# EAGLE design Cape4all_Beaglebone_Audio_Extension_Rev2 (EAGLE 7.7.0)

## Sheet 1 of 2
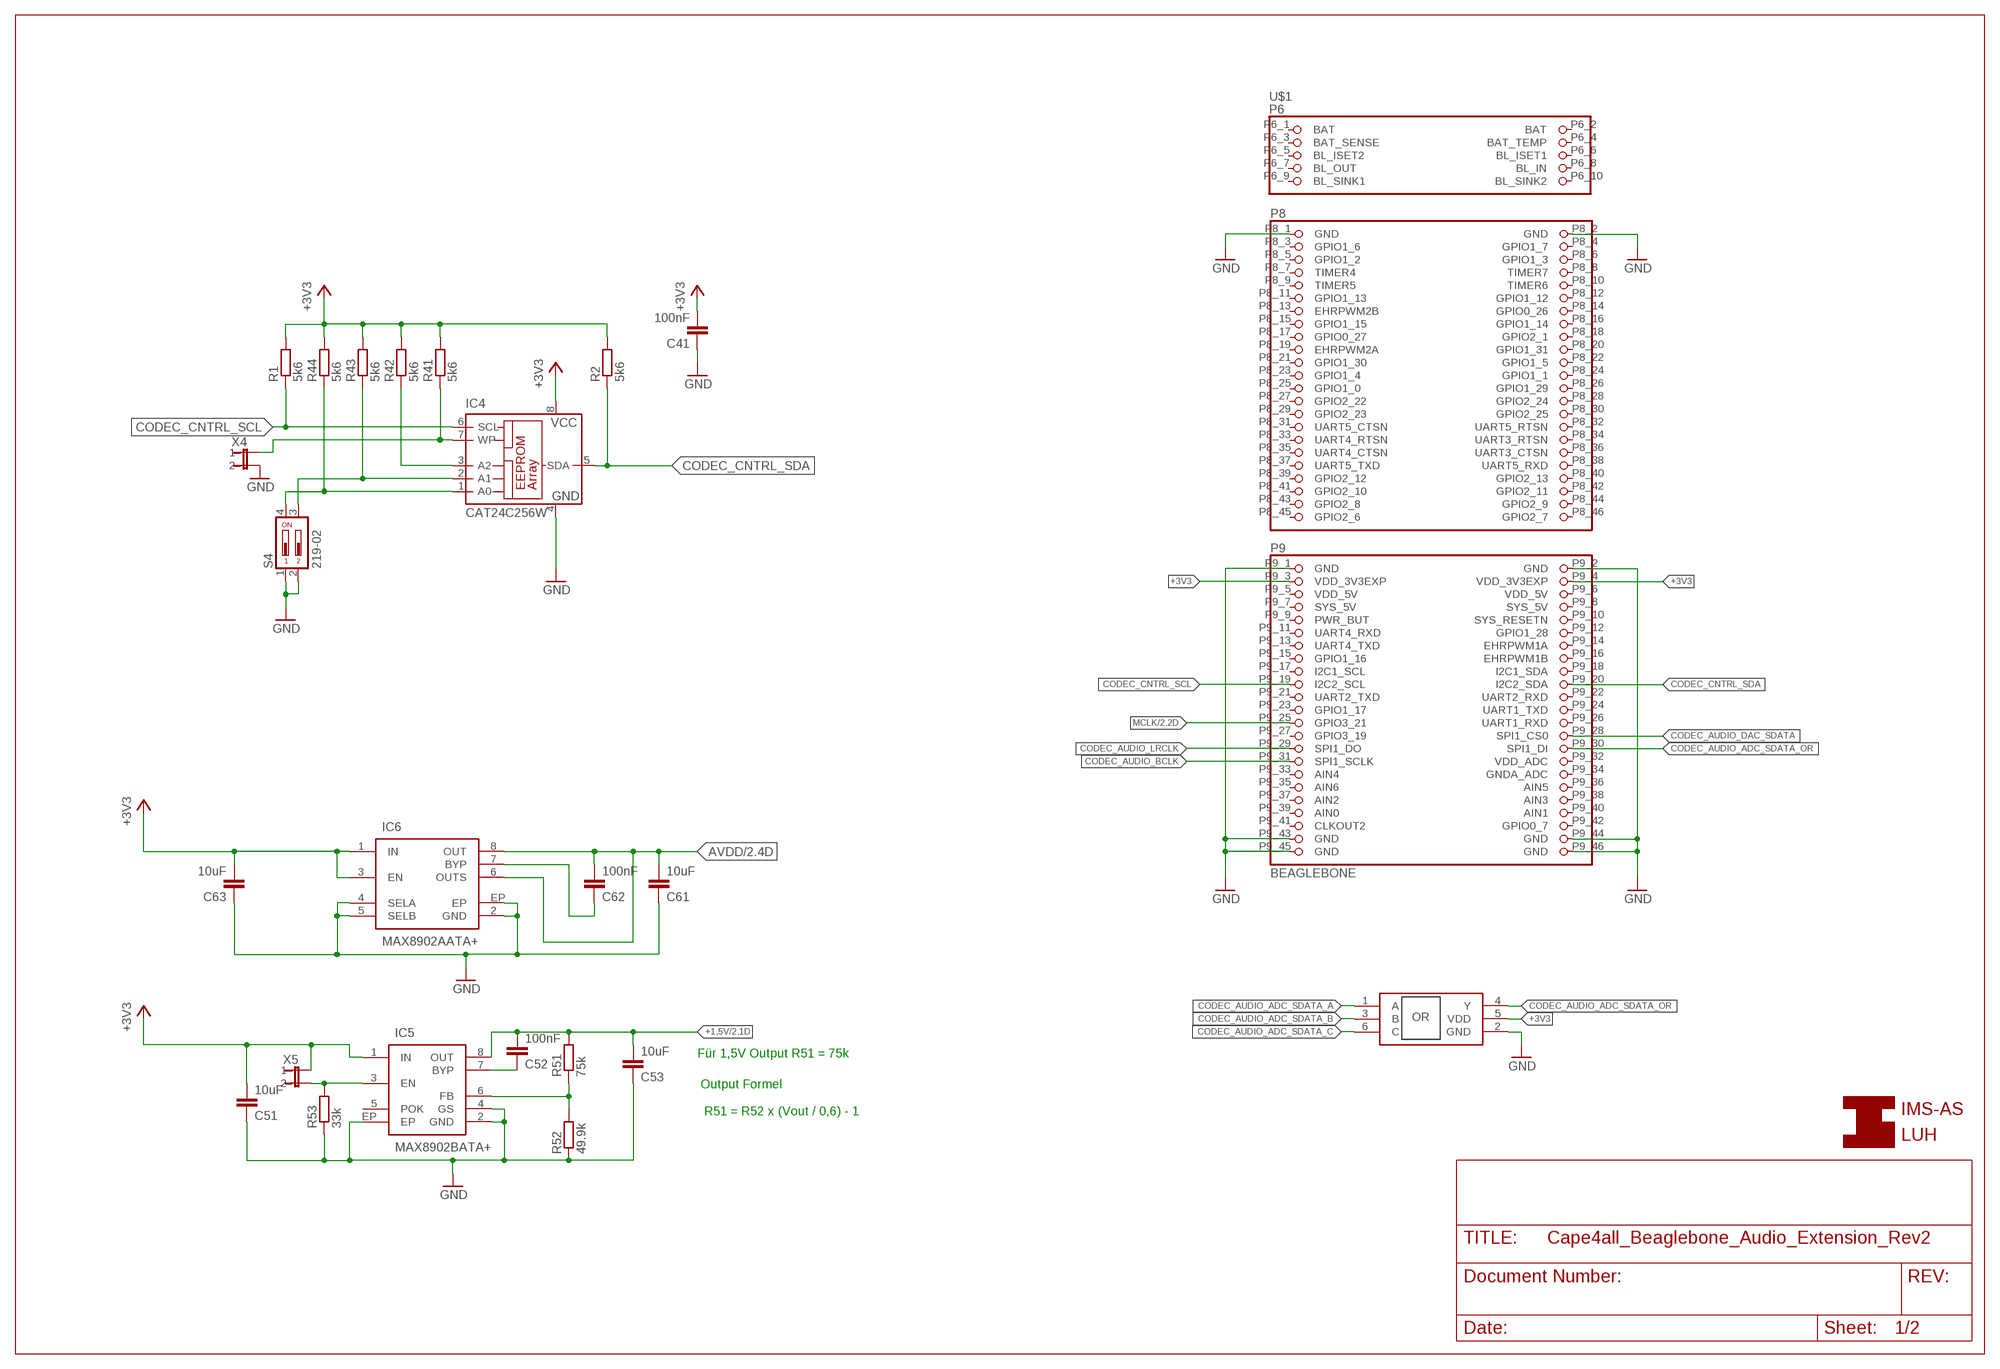
[diagram p0: schematic, sheet 1]

### Parts
C41  100nF  C-EUC0603  [C0603]
C51  10uF  C-EUC0603  [C0603]
C52  100nF  C-EUC0603  [C0603]
C53  10uF  C-EUC0603  [C0603]
C61  10uF  C-EUC0603  [C0603]
C62  100nF  C-EUC0603  [C0603]
C63  10uF  C-EUC0603  [C0603]
IC4  CAT24C256W  24C01ASN  [SO-08]
IC5  MAX8902BATA+  MAX8902B  [8-TDFN-EP]
IC6  MAX8902AATA+  MAX8902A  [8-TDFN-EP]
IC7  SN74LVC1G332SMD  [SOT23-6L]
R1  5k6  R-EU_R0603  [R0603]
R2  5k6  R-EU_R0603  [R0603]
R41  5k6  R-EU_R0603  [R0603]
R42  5k6  R-EU_R0603  [R0603]
R43  5k6  R-EU_R0603  [R0603]
R44  5k6  R-EU_R0603  [R0603]
R51  75k  R-EU_R0603  [R0603]
R52  49.9k  R-EU_R0603  [R0603]
R53  33k  R-EU_R0603  [R0603]
S4  219-02  [CTS-219-02]
U$1  BEAGLEBONE  [BEAGLEBONE]
X4  JP1X2  [JP1X2]
X5  JP1X2  [JP1X2]

### Nets
+1,5V: C52.2 C53.2 IC5.8(OUT) R51.2 ; also sheet 2
+3V3: C41.2 C51.2 C63.2 IC4.8(VCC) IC5.1(IN) IC6.1(IN) IC6.3(EN) IC7.5(VDD) R1.2 R2.2 R41.2 R42.2 R43.2 R44.2 U$1.P9_3(VDD_3V3EXP) U$1.P9_4(VDD_3V3EXP) X5.1 ; also sheet 2
AVDD: C61.2 C62.2 IC6.6(OUTS) IC6.8(OUT) ; also sheet 2
CODEC_AUDIO_ADC_SDATA_A: IC7.1(A) ; also sheet 2
CODEC_AUDIO_ADC_SDATA_B: IC7.3(B) ; also sheet 2
CODEC_AUDIO_ADC_SDATA_C: IC7.6(C) ; also sheet 2
CODEC_AUDIO_ADC_SDATA_OR: IC7.4(Y) U$1.P9_30(SPI1_DI)
CODEC_AUDIO_BCLK: U$1.P9_31(SPI1_SCLK) ; also sheet 2
CODEC_AUDIO_DAC_SDATA: U$1.P9_28(SPI1_CS0) ; also sheet 2
CODEC_AUDIO_LRCLK: U$1.P9_29(SPI1_DO) ; also sheet 2
CODEC_CNTRL_SCL: IC4.6(SCL) R1.1 U$1.P9_19(I2C2_SCL) ; also sheet 2
CODEC_CNTRL_SDA: IC4.5(SDA) R2.1 U$1.P9_20(I2C2_SDA) ; also sheet 2
GND: C41.1 C51.1 C53.1 C61.1 C63.1 IC4.4(GND) IC5.2(GND) IC5.4(GS) IC5.EP IC6.2(GND) IC6.4(SELA) IC6.5(SELB) IC6.EP IC7.2(GND) R52.1 R53.1 S4.1 S4.2 U$1.P8_1(GND) U$1.P8_2(GND) U$1.P9_1(GND) U$1.P9_2(GND) U$1.P9_43(GND) U$1.P9_44(GND) U$1.P9_45(GND) U$1.P9_46(GND) X4.2 ; also sheet 2
MCLK: U$1.P9_25(GPIO3_21) ; also sheet 2
N$7: IC5.3(EN) R53.2 X5.2
N$8: IC4.3(A2) R42.1
N$9: IC4.2(A1) R43.1 S4.3
N$10: IC4.1(A0) R44.1 S4.4
N$11: IC4.7(WP) R41.1 X4.1
N$27: C52.1 IC5.7(BYP)
N$28: IC5.6(FB) R51.1 R52.2
N$34: C62.1 IC6.7(BYP)
Unconnected: IC5.5(POK) U$1.P6_1(BAT) U$1.P6_2(BAT) U$1.P6_3(BAT_SENSE) U$1.P6_4(BAT_TEMP) U$1.P6_5(BL_ISET2) U$1.P6_6(BL_ISET1) U$1.P6_7(BL_OUT) U$1.P6_8(BL_IN) U$1.P6_9(BL_SINK1) U$1.P6_10(BL_SINK2) U$1.P8_3(GPIO1_6) U$1.P8_4(GPIO1_7) U$1.P8_5(GPIO1_2) U$1.P8_6(GPIO1_3) U$1.P8_7(TIMER4) U$1.P8_8(TIMER7) U$1.P8_9(TIMER5) U$1.P8_10(TIMER6) U$1.P8_11(GPIO1_13) U$1.P8_12(GPIO1_12) U$1.P8_13(EHRPWM2B) U$1.P8_14(GPIO0_26) U$1.P8_15(GPIO1_15) U$1.P8_16(GPIO1_14) U$1.P8_17(GPIO0_27) U$1.P8_18(GPIO2_1) U$1.P8_19(EHRPWM2A) U$1.P8_20(GPIO1_31) U$1.P8_21(GPIO1_30) U$1.P8_22(GPIO1_5) U$1.P8_23(GPIO1_4) U$1.P8_24(GPIO1_1) U$1.P8_25(GPIO1_0) U$1.P8_26(GPIO1_29) U$1.P8_27(GPIO2_22) U$1.P8_28(GPIO2_24) U$1.P8_29(GPIO2_23) U$1.P8_30(GPIO2_25) U$1.P8_31(UART5_CTSN) U$1.P8_32(UART5_RTSN) U$1.P8_33(UART4_RTSN) U$1.P8_34(UART3_RTSN) U$1.P8_35(UART4_CTSN) U$1.P8_36(UART3_CTSN) U$1.P8_37(UART5_TXD) U$1.P8_38(UART5_RXD) U$1.P8_39(GPIO2_12) U$1.P8_40(GPIO2_13) U$1.P8_41(GPIO2_10) U$1.P8_42(GPIO2_11) U$1.P8_43(GPIO2_8) U$1.P8_44(GPIO2_9) U$1.P8_45(GPIO2_6) U$1.P8_46(GPIO2_7) U$1.P9_5(VDD_5V) U$1.P9_6(VDD_5V) U$1.P9_7(SYS_5V) U$1.P9_8(SYS_5V) U$1.P9_9(PWR_BUT) U$1.P9_10(SYS_RESETN) U$1.P9_11(UART4_RXD) U$1.P9_12(GPIO1_28) U$1.P9_13(UART4_TXD) U$1.P9_14(EHRPWM1A) U$1.P9_15(GPIO1_16) U$1.P9_16(EHRPWM1B) U$1.P9_17(I2C1_SCL) U$1.P9_18(I2C1_SDA) U$1.P9_21(UART2_TXD) U$1.P9_22(UART2_RXD) U$1.P9_23(GPIO1_17) U$1.P9_24(UART1_TXD) U$1.P9_26(UART1_RXD) U$1.P9_27(GPIO3_19) U$1.P9_32(VDD_ADC) U$1.P9_33(AIN4) U$1.P9_34(GNDA_ADC) U$1.P9_35(AIN6) U$1.P9_36(AIN5) U$1.P9_37(AIN2) U$1.P9_38(AIN3) U$1.P9_39(AIN0) U$1.P9_40(AIN1) U$1.P9_41(CLKOUT2) U$1.P9_42(GPIO0_7)

### Notes on the sheet
- Für 1,5V Output R51 = 75k
- Output Formel
  
   R51 = R52 x (Vout / 0,6) - 1

## Sheet 2 of 2
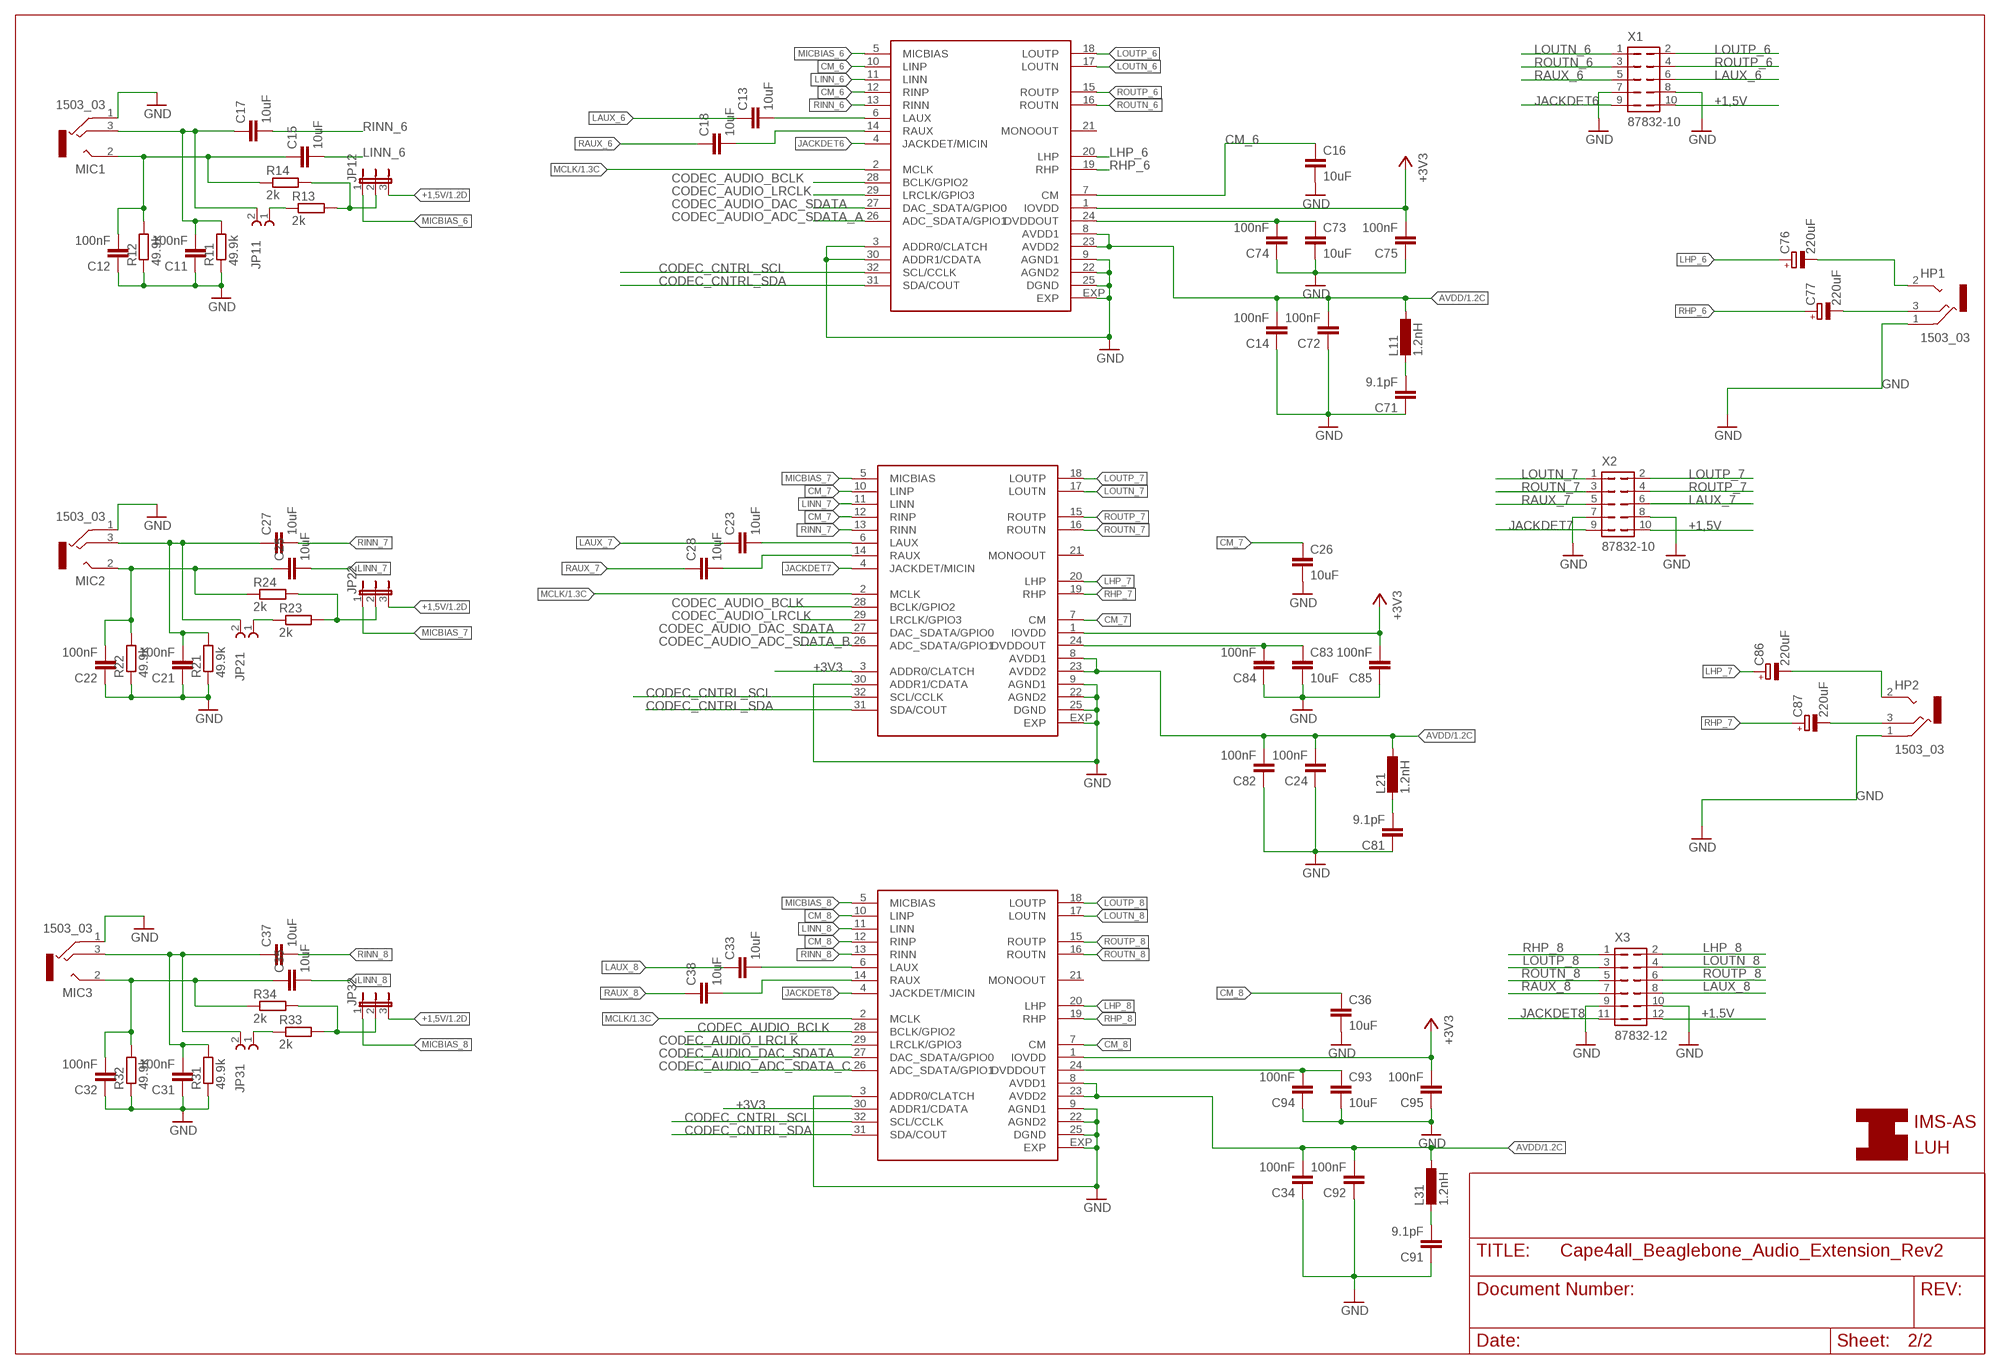
[diagram p1: schematic, sheet 2]

### Parts
C11  100nF  C-EUC0603  [C0603]
C12  100nF  C-EUC0603  [C0603]
C13  10uF  C-EUC0603  [C0603]
C14  100nF  C-EUC0603  [C0603]
C15  10uF  C-EUC0603  [C0603]
C16  10uF  C-EUC0603  [C0603]
C17  10uF  C-EUC0603  [C0603]
C18  10uF  C-EUC0603  [C0603]
C21  100nF  C-EUC0603  [C0603]
C22  100nF  C-EUC0603  [C0603]
C23  10uF  C-EUC0603  [C0603]
C24  100nF  C-EUC0603  [C0603]
C25  10uF  C-EUC0603  [C0603]
C26  10uF  C-EUC0603  [C0603]
C27  10uF  C-EUC0603  [C0603]
C28  10uF  C-EUC0603  [C0603]
C31  100nF  C-EUC0603  [C0603]
C32  100nF  C-EUC0603  [C0603]
C33  10uF  C-EUC0603  [C0603]
C34  100nF  C-EUC0603  [C0603]
C35  10uF  C-EUC0603  [C0603]
C36  10uF  C-EUC0603  [C0603]
C37  10uF  C-EUC0603  [C0603]
C38  10uF  C-EUC0603  [C0603]
C71  9.1pF  C-EUC0603  [C0603]
C72  100nF  C-EUC0603  [C0603]
C73  10uF  C-EUC0603  [C0603]
C74  100nF  C-EUC0603  [C0603]
C75  100nF  C-EUC0603  [C0603]
C76  220uF  CPOL-EUB/3528-21R  [B/3528-21R]
C77  220uF  CPOL-EUB/3528-21R  [B/3528-21R]
C81  9.1pF  C-EUC0603  [C0603]
C82  100nF  C-EUC0603  [C0603]
C83  10uF  C-EUC0603  [C0603]
C84  100nF  C-EUC0603  [C0603]
C85  100nF  C-EUC0603  [C0603]
C86  220uF  CPOL-EUB/3528-21R  [B/3528-21R]
C87  220uF  CPOL-EUB/3528-21R  [B/3528-21R]
C91  9.1pF  C-EUC0603  [C0603]
C92  100nF  C-EUC0603  [C0603]
C93  10uF  C-EUC0603  [C0603]
C94  100nF  C-EUC0603  [C0603]
C95  100nF  C-EUC0603  [C0603]
HP1  1503_03  [1503_03]
HP2  1503_03  [1503_03]
IC1  ADAU1761BCPZ  ADAU1761  [LFCSP32]
IC2  ADAU1761BCPZ  ADAU1761  [LFCSP32]
IC3  ADAU1761BCPZ  ADAU1761  [LFCSP32]
JP11  62000211121  [62000211121]
JP12  JP1X3  [JP1X3]
JP21  62000211121  [62000211121]
JP22  JP1X3  [JP1X3]
JP31  62000211121  [62000211121]
JP32  JP1X3  [JP1X3]
L11  1.2nH  L-EUL0603  [R0603]
L21  1.2nH  L-EUL0603  [R0603]
L31  1.2nH  L-EUL0603  [R0603]
MIC1  1503_03  [1503_03]
MIC2  1503_03  [1503_03]
MIC3  1503_03  [1503_03]
R11  49.9k  R-EU_R0603  [R0603]
R12  49.9k  R-EU_R0603  [R0603]
R13  2k  R-EU_R0603  [R0603]
R14  2k  R-EU_R0603  [R0603]
R21  49.9k  R-EU_R0603  [R0603]
R22  49.9k  R-EU_R0603  [R0603]
R23  2k  R-EU_R0603  [R0603]
R24  2k  R-EU_R0603  [R0603]
R31  49.9k  R-EU_R0603  [R0603]
R32  49.9k  R-EU_R0603  [R0603]
R33  2k  R-EU_R0603  [R0603]
R34  2k  R-EU_R0603  [R0603]
X1  87832-10  [87832-10]
X2  87832-10  [87832-10]
X3  87832-12  [87832-12]

### Nets
+1,5V: JP12.3 JP22.3 JP32.3 X1.10 X2.10 X3.12 ; also sheet 1
+3V3: C75.2 C85.2 C95.2 IC1.1(IOVDD) IC2.1(IOVDD) IC2.3(ADDR0/CLATCH) IC3.1(IOVDD) IC3.30(ADDR1/CDATA) ; also sheet 1
AVDD: C14.2 C24.2 C34.2 C72.2 C82.2 C92.2 IC1.8(AVDD1) IC1.23(AVDD2) IC2.8(AVDD1) IC2.23(AVDD2) IC3.8(AVDD1) IC3.23(AVDD2) L11.1 L21.1 L31.1 ; also sheet 1
CM_6: C16.1 IC1.7(CM) IC1.10(LINP) IC1.12(RINP)
CM_7: C26.1 IC2.7(CM) IC2.10(LINP) IC2.12(RINP)
CM_8: C36.1 IC3.7(CM) IC3.10(LINP) IC3.12(RINP)
CODEC_AUDIO_ADC_SDATA_A: IC1.26(ADC_SDATA/GPIO1) ; also sheet 1
CODEC_AUDIO_ADC_SDATA_B: IC2.26(ADC_SDATA/GPIO1) ; also sheet 1
CODEC_AUDIO_ADC_SDATA_C: IC3.26(ADC_SDATA/GPIO1) ; also sheet 1
CODEC_AUDIO_BCLK: IC1.28(BCLK/GPIO2) IC2.28(BCLK/GPIO2) IC3.28(BCLK/GPIO2) ; also sheet 1
CODEC_AUDIO_DAC_SDATA: IC1.27(DAC_SDATA/GPIO0) IC2.27(DAC_SDATA/GPIO0) IC3.27(DAC_SDATA/GPIO0) ; also sheet 1
CODEC_AUDIO_LRCLK: IC1.29(LRCLK/GPIO3) IC2.29(LRCLK/GPIO3) IC3.29(LRCLK/GPIO3) ; also sheet 1
CODEC_CNTRL_SCL: IC1.32(SCL/CCLK) IC2.32(SCL/CCLK) IC3.32(SCL/CCLK) ; also sheet 1
CODEC_CNTRL_SDA: IC1.31(SDA/COUT) IC2.31(SDA/COUT) IC3.31(SDA/COUT) ; also sheet 1
DVDDOUT_6: C73.1 C74.2 IC1.24(DVDDOUT)
DVDDOUT_7: C83.1 C84.2 IC2.24(DVDDOUT)
DVDDOUT_8: C93.1 C94.2 IC3.24(DVDDOUT)
GND: C11.1 C12.1 C14.1 C16.2 C21.1 C22.1 C24.1 C26.2 C31.1 C32.1 C34.1 C36.2 C71.1 C72.1 C73.2 C74.1 C75.1 C81.1 C82.1 C83.2 C84.1 C85.1 C91.1 C92.1 C93.2 C94.1 C95.1 HP1.1 HP2.1 IC1.3(ADDR0/CLATCH) IC1.9(AGND1) IC1.22(AGND2) IC1.25(DGND) IC1.30(ADDR1/CDATA) IC1.EXP IC2.9(AGND1) IC2.22(AGND2) IC2.25(DGND) IC2.30(ADDR1/CDATA) IC2.EXP IC3.3(ADDR0/CLATCH) IC3.9(AGND1) IC3.22(AGND2) IC3.25(DGND) IC3.EXP MIC1.1 MIC2.1 MIC3.1 R11.1 R12.1 R21.1 R22.1 R31.1 R32.1 X1.7 X1.8 X2.7 X2.8 X3.9 X3.10 ; also sheet 1
JACKDET6: IC1.4(JACKDET/MICIN) X1.9
JACKDET7: IC2.4(JACKDET/MICIN) X2.9
JACKDET8: IC3.4(JACKDET/MICIN) X3.11
LAUX_6: C13.1 X1.6
LAUX_7: C23.1 X2.6
LAUX_8: C33.1 X3.8
LHP_6: C76.+ IC1.20(LHP)
LHP_7: C86.+ IC2.20(LHP)
LHP_8: IC3.20(LHP) X3.2
LINN_6: C15.2 IC1.11(LINN)
LINN_7: C25.2 IC2.11(LINN)
LINN_8: C35.2 IC3.11(LINN)
LOUTN_6: IC1.17(LOUTN) X1.1
LOUTN_7: IC2.17(LOUTN) X2.1
LOUTN_8: IC3.17(LOUTN) X3.4
LOUTP_6: IC1.18(LOUTP) X1.2
LOUTP_7: IC2.18(LOUTP) X2.2
LOUTP_8: IC3.18(LOUTP) X3.3
MCLK: IC1.2(MCLK) IC2.2(MCLK) IC3.2(MCLK) ; also sheet 1
MIC1L: C12.2 C15.1 MIC1.2 R12.2 R14.1
MIC1R: C11.2 C17.1 JP11.2 MIC1.3 R11.2
MIC2L: C22.2 C25.1 MIC2.2 R22.2 R24.1
MIC2R: C21.2 C27.1 JP21.2 MIC2.3 R21.2
MIC3L: C32.2 C35.1 MIC3.2 R32.2 R34.1
MIC3R: C31.2 C37.1 JP31.2 MIC3.3 R31.2
MICBIAS_6: IC1.5(MICBIAS) JP12.1
MICBIAS_7: IC2.5(MICBIAS) JP22.1
MICBIAS_8: IC3.5(MICBIAS) JP32.1
N$1: C91.2 L31.2
N$2: C71.2 L11.2
N$3: C23.2 IC2.6(LAUX)
N$4: C28.2 IC2.14(RAUX)
N$5: C13.2 IC1.6(LAUX)
N$6: C18.2 IC1.14(RAUX)
N$12: C33.2 IC3.6(LAUX)
N$13: C38.2 IC3.14(RAUX)
N$14: JP11.1 R13.1
N$15: JP21.1 R23.1
N$18: JP31.1 R33.1
N$29: JP32.2 R33.2 R34.2
N$31: JP12.2 R13.2 R14.2
N$32: JP22.2 R23.2 R24.2
N$56: C87.- HP2.3
N$65: C86.- HP2.2
N$91: C81.2 L21.2
N$94: C77.- HP1.3
N$95: C76.- HP1.2
RAUX_6: C18.1 X1.5
RAUX_7: C28.1 X2.5
RAUX_8: C38.1 X3.7
RHP_6: C77.+ IC1.19(RHP)
RHP_7: C87.+ IC2.19(RHP)
RHP_8: IC3.19(RHP) X3.1
RINN_6: C17.2 IC1.13(RINN)
RINN_7: C27.2 IC2.13(RINN)
RINN_8: C37.2 IC3.13(RINN)
ROUTN_6: IC1.16(ROUTN) X1.3
ROUTN_7: IC2.16(ROUTN) X2.3
ROUTN_8: IC3.16(ROUTN) X3.5
ROUTP_6: IC1.15(ROUTP) X1.4
ROUTP_7: IC2.15(ROUTP) X2.4
ROUTP_8: IC3.15(ROUTP) X3.6
Unconnected: HP1.GND HP1.GND2 HP2.GND HP2.GND2 IC1.21(MONOOUT) IC2.21(MONOOUT) IC3.21(MONOOUT) MIC1.GND MIC1.GND2 MIC2.GND MIC2.GND2 MIC3.GND MIC3.GND2

## Library data of the parts
C11-C18 C21-C28 C31-C38 C41 C51-C53 C61-C63 C71-C75 C81-C85 C91-C95 = rcl:C-EU: CAPACITOR, European symbol
C76 C77 C86 C87 = rcl:CPOL-EU: POLARIZED CAPACITOR, European symbol
HP1 HP2 MIC1-MIC3 = con-lumberg:1503_03: Jack connectors according to JISC 6560, 3.5 mm Klinkeneinbaukupplung nach JISC 6560, 3,5 mm, 3-polig/stereo, abgewinkelte Ausführung, Surface-Mount-Technik (SMT) Source: http://www.lumberg.com/Produkte/PDFs/1503_02.pdf
IC1-IC3 = audio:ADAU1761: Analog Devices ADAU1761 Audio Codec
IC4 = microchip:24C*: Serial EEPROM 1 K/2 K/4 K
IC5 = regulators:MAX8902B: Maxim Low-Noise 500mA LDO Regulator in a 2mm x 2mm TDFN Package
IC6 = regulators:MAX8902A: Maxim Integrated MAX8902A Low-Noise 500mA LDO Regulator
IC7 = audio:SN74LVC1G332: 3-Input OR-Gate SMD SOT23-6 Farnell: SN74LVC1G332DBVR (2334917) <http://de.farnell.com/texas-instruments/sn74lvc1g332dbvr/logic-or-gate-sot-23-6/dp/2334917>
JP11 JP21 JP31 = EAGLE-BOARD-TO-BOARD_CONNECTORS-rev17a:62000211121: WR-PHD 2.00mm Pin Header, 2 Pins=>Code : Con_BTB_PHD_2.00_1_THT_62000211121 <http://katalog.we-online.de/media/images/eican/Con_BTB_PHD_2.00_1_THT_6200xx11121_pf2.jpg> Details see: http://katalog.we-online.de/en/em/620_0xx_111_21 Created 2014-06-03, Karrer Zheng 2014 (C) Würth Elektronik
JP12 JP22 JP32 = lib_soeren:JP1X3: Jumper 1x3
L11 L21 L31 = rcl:L-EU: INDUCTOR, European symbol
R1 R2 R11-R14 R21-R24 R31-R34 R41-R44 R51-R53 = rcl:R-EU_: RESISTOR, European symbol
S4 = switch-dil:219-02*: Surface Mount DIP Switch Series 219 SMT CTS Electronic Components Sourc: www.ctscorp.com
U$1 = lib_soeren:BEAGLEBONE: BeagleBoneBlack Cape nach BeagleBone Black System Reference Manual Rev. C1
X1 X2 = con-molex:87832-10: Milli-Grid Header 2.00mm (.079") Pitch
X3 = con-molex:87832-12: Milli-Grid Header 2.00mm (.079") Pitch
X4 X5 = lib_soeren:JP1X2: Jumper 1x2

## Board
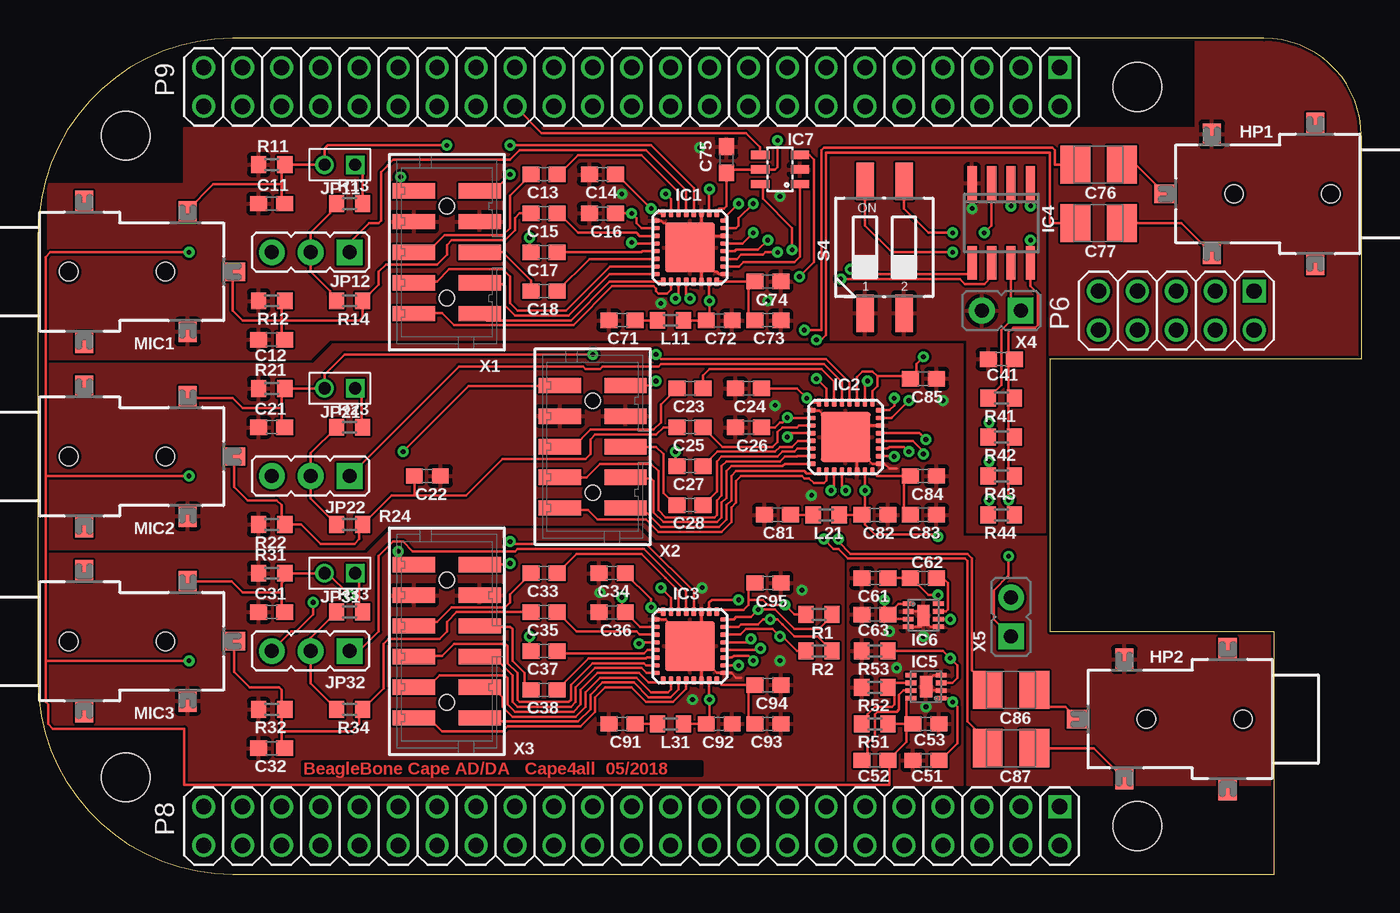
[diagram p2: board, top side]
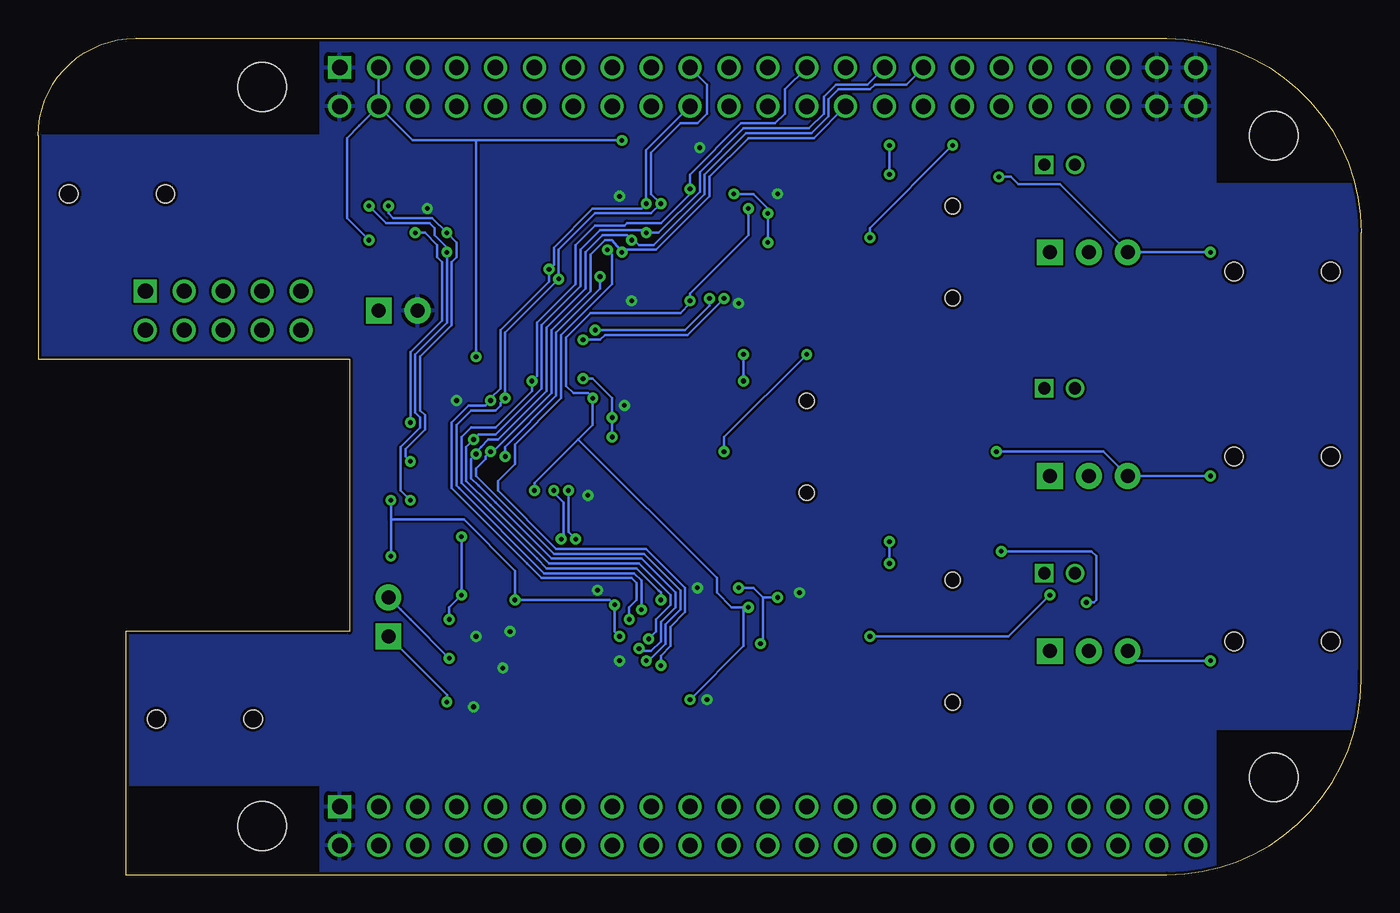
[diagram p3: board, bottom side, seen from below]

Size 86.36 x 54.61 mm. Coordinates in mm from the lower left corner, seen from the top.
Copper layers (1+2*15+16): Top 0.035mm / dielectric 0.36mm / Route2 0.018mm / dielectric 0.71mm / Route15 0.018mm / dielectric 0.36mm / Bottom 0.035mm
Design rules "qp_designrules_6mil *": minimum track width 6mil, minimum drill 0.3mm, track to track 6mil, track to pad 6mil, pad to pad 6mil, via to via 6mil, smd to smd 6mil, copper to edge 8mil, drill to drill 10mil, minimum pad ring 8mil, minimum via ring 8mil, stop-mask expansion 4mil, vias tented up to drill 16mil, thermal gap 10mil

### Footprints (pad centres in the part's own frame; a part is rotated, then mirrored left to right if it is on the bottom)
C0603 = smd 1.1 x 1: 1 -0.85,0; 2 0.85,0
B/3528-21R = smd 1.95 x 2.5: + 1.525,0; - -1.525,0
1503_03 = smd 1.4 x 1.2: 1 -3.9,-9.75; 3 3.9,-9.75; GND -4.6,-3; GND2 4.6,-3 | smd 1.2 x 1.4: 2 0,-12.8 | hole 1.2: 0,-2; 0,-8.3
LFCSP32 = smd 0.55 x 0.3: 1 -2.25,1.75; 2 -2.25,1.25; 3 -2.25,0.75; 4 -2.25,0.25; 5 -2.25,-0.25; 6 -2.25,-0.75; 7 -2.25,-1.25; 8 -2.25,-1.75; 17 2.25,-1.75; 18 2.25,-1.25; 19 2.25,-0.75; 20 2.25,-0.25; 21 2.25,0.25; 22 2.25,0.75; 23 2.25,1.25; 24 2.25,1.75 | smd 0.3 x 0.55: 9 -1.75,-2.25; 10 -1.25,-2.25; 11 -0.75,-2.25; 12 -0.25,-2.25; 13 0.25,-2.25; 14 0.75,-2.25; 15 1.25,-2.25; 16 1.75,-2.25; 25 1.75,2.25; 26 1.25,2.25; 27 0.75,2.25; 28 0.25,2.25; 29 -0.25,2.25; 30 -0.75,2.25; 31 -1.25,2.25; 32 -1.75,2.25 | smd 3.25 x 3.25: EXP 0,0
SO-08 = smd 0.6 x 2.2: 1 -1.905,-2.6; 2 -0.635,-2.6; 3 0.635,-2.6; 4 1.905,-2.6; 5 1.905,2.6; 6 0.635,2.6; 7 -0.635,2.6; 8 -1.905,2.6
8-TDFN-EP = smd 0.7 x 0.3: 1 -1,0.7; 2 -1,0.2; 3 -1,-0.3; 4 -1,-0.8; 5 0.98,-0.8; 6 0.98,-0.3; 7 0.98,0.2; 8 0.98,0.7 | smd 0.8 x 1.38: EP -0.01,-0.05
SOT23-6L = smd 0.55 x 1.2: 1 -0.95,-1.3; 2 0,-1.3; 3 0.95,-1.3; 4 0.95,1.3; 5 0,1.3; 6 -0.95,1.3
62000211121 = drill 0.8 square: 1 -1,0 | drill 0.8: 2 1,0
JP1X3 = drill 0.914 pad 1.676 square: 1 -2.54,0 | drill 0.914 pad 1.676: 2 0,0; 3 2.54,0
R0603 = smd 1 x 1.1: 1 -0.85,0; 2 0.85,0
CTS-219-02 = smd 1.13 x 2.44: 1 -1.27,-4.3; 2 1.27,-4.3; 3 1.27,4.3; 4 -1.27,4.3
BEAGLEBONE = drill 1 square: P6_1 6.985,16.51; P8_1 19.685,50.165; P9_1 19.685,1.905 | drill 1: P6_2 6.985,19.05; P6_3 9.525,16.51; P6_4 9.525,19.05; P6_5 12.065,16.51; P6_6 12.065,19.05; P6_7 14.605,16.51; P6_8 14.605,19.05; P6_9 17.145,16.51; P6_10 17.145,19.05; P8_2 19.685,52.705; P8_3 22.225,50.165; P8_4 22.225,52.705; P8_5 24.765,50.165; P8_6 24.765,52.705; P8_7 27.305,50.165; P8_8 27.305,52.705; P8_9 29.845,50.165; P8_10 29.845,52.705; P8_11 32.385,50.165; P8_12 32.385,52.705; P8_13 34.925,50.165; P8_14 34.925,52.705; P8_15 37.465,50.165; P8_16 37.465,52.705; P8_17 40.005,50.165; P8_18 40.005,52.705; P8_19 42.545,50.165; P8_20 42.545,52.705; P8_21 45.085,50.165; P8_22 45.085,52.705; P8_23 47.625,50.165; P8_24 47.625,52.705; P8_25 50.165,50.165; P8_26 50.165,52.705; P8_27 52.705,50.165; P8_28 52.705,52.705; P8_29 55.245,50.165; P8_30 55.245,52.705; P8_31 57.785,50.165; P8_32 57.785,52.705; P8_33 60.325,50.165; P8_34 60.325,52.705; P8_35 62.865,50.165; P8_36 62.865,52.705; P8_37 65.405,50.165; P8_38 65.405,52.705; P8_39 67.945,50.165; P8_40 67.945,52.705; P8_41 70.485,50.165; P8_42 70.485,52.705; P8_43 73.025,50.165; P8_44 73.025,52.705; P8_45 75.565,50.165; P8_46 75.565,52.705; P9_2 19.685,4.445; P9_3 22.225,1.905; P9_4 22.225,4.445; P9_5 24.765,1.905; P9_6 24.765,4.445; P9_7 27.305,1.905; P9_8 27.305,4.445; P9_9 29.845,1.905; P9_10 29.845,4.445; P9_11 32.385,1.905; P9_12 32.385,4.445; P9_13 34.925,1.905; P9_14 34.925,4.445; P9_15 37.465,1.905; P9_16 37.465,4.445; P9_17 40.005,1.905; P9_18 40.005,4.445; P9_19 42.545,1.905; P9_20 42.545,4.445; P9_21 45.085,1.905; P9_22 45.085,4.445; P9_23 47.625,1.905; P9_24 47.625,4.445; P9_25 50.165,1.905; P9_26 50.165,4.445; P9_27 52.705,1.905; P9_28 52.705,4.445; P9_29 55.245,1.905; P9_30 55.245,4.445; P9_31 57.785,1.905; P9_32 57.785,4.445; P9_33 60.325,1.905; P9_34 60.325,4.445; P9_35 62.865,1.905; P9_36 62.865,4.445; P9_37 65.405,1.905; P9_38 65.405,4.445; P9_39 67.945,1.905; P9_40 67.945,4.445; P9_41 70.485,1.905; P9_42 70.485,4.445; P9_43 73.025,1.905; P9_44 73.025,4.445; P9_45 75.565,1.905; P9_46 75.565,4.445 | hole 3.175: 14.605,3.175; 14.605,51.435; 80.645,6.35; 80.645,48.26
87832-10 = smd 1 x 2.75: 1 -4,-2.15; 2 -4,2.15; 3 -2,-2.15; 4 -2,2.15; 5 0,-2.15; 6 0,2.15; 7 2,-2.15; 8 2,2.15; 9 4,-2.15; 10 4,2.15 | hole 1: -3,0; 3,0
87832-12 = smd 1 x 2.75: 1 -5,-2.15; 2 -5,2.15; 3 -3,-2.15; 4 -3,2.15; 5 -1,-2.15; 6 -1,2.15; 7 1,-2.15; 8 1,2.15; 9 3,-2.15; 10 3,2.15; 11 5,-2.15; 12 5,2.15 | hole 1: -4,0; 4,0
JP1X2 = drill 0.914 pad 1.676 square: 1 -1.27,0 | drill 0.914 pad 1.676: 2 1.27,0

### Placement (x,y rotation side)
C11  15.24,43.81 0 top
C12  15.24,34.92 0 top
C13  33.02,45.72 0 top
C14  36.83,45.72 0 top
C15  33.02,43.18 0 top
C16  36.83,43.18 180 top
C17  33.02,40.64 0 top
C18  33.02,38.1 0 top
C21  15.24,29.21 0 top
C22  25.4,26.04 180 top
C23  42.55,31.75 0 top
C24  46.35,31.75 0 top
C25  42.55,29.21 0 top
C26  46.35,29.21 180 top
C27  42.55,26.67 0 top
C28  42.55,24.13 0 top
C31  15.24,17.14 0 top
C32  15.24,8.26 0 top
C33  33.02,19.68 0 top
C34  37.47,19.68 0 top
C35  33.02,17.14 0 top
C36  37.47,17.14 180 top
C37  33.02,14.61 0 top
C38  33.02,12.06 0 top
C41  62.86,33.66 0 top
C51  57.94,7.46 0 top
C52  54.61,7.46 0 top
C53  57.94,9.84 180 top
C61  54.61,19.37 0 top
C62  57.78,19.37 180 top
C63  54.61,16.99 0 top
C71  38.1,36.2 0 top
C72  44.45,36.2 180 top
C73  47.62,36.2 0 top
C74  47.62,38.73 180 top
C75  44.93,46.67 270 top
C76  69.22,46.35 180 top
C77  69.22,42.55 180 top
C81  48.26,23.5 0 top
C82  54.61,23.5 180 top
C83  57.78,23.5 0 top
C84  57.78,26.04 180 top
C85  57.78,32.38 180 top
C86  63.5,12.06 180 top
C87  63.5,8.26 180 top
C91  38.1,9.84 0 top
C92  44.45,9.84 180 top
C93  47.62,9.84 0 top
C94  47.62,12.38 180 top
C95  47.62,19.05 180 top
HP1  86.36,44.45 270 top
HP2  80.64,10.16 270 top
IC1  42.55,40.96 270 top
IC2  52.7,28.57 270 top
IC3  42.55,14.92 270 top
IC4  62.87,42.55 180 top
IC5  57.94,12.22 180 top
IC6  57.78,16.99 0 top
IC7  48.42,46.04 90 top
JP11  19.68,46.35 180 top
JP12  17.78,40.64 180 top
JP21  19.68,31.75 180 top
JP22  17.78,26.04 180 top
JP31  19.68,19.68 180 top
JP32  17.78,14.61 180 top
L11  41.27,36.2 180 top
L21  51.44,23.5 180 top
L31  41.27,9.84 180 top
MIC1  0,39.37 90 top
MIC2  0,27.3 90 top
MIC3  0,15.24 90 top
R1  50.96,16.99 180 top
R2  50.96,14.61 180 top
R11  15.24,46.35 0 top
R12  15.24,37.47 0 top
R13  20.32,43.81 180 top
R14  20.32,37.47 180 top
R21  15.24,31.75 0 top
R22  15.24,22.86 0 top
R23  20.32,29.21 180 top
R24  20.32,22.86 180 top
R31  15.24,19.68 0 top
R32  15.24,10.79 0 top
R33  20.32,17.14 180 top
R34  20.32,10.79 180 top
R41  62.87,31.11 0 top
R42  62.87,28.57 0 top
R43  62.87,26.04 0 top
R44  62.87,23.5 0 top
R51  54.61,9.84 0 top
R52  54.61,12.22 0 top
R53  54.61,14.61 0 top
S4  55.24,40.96 0 top
U$1  86.36,54.61 180 top
X1  26.67,40.64 90 top
X2  36.2,27.94 90 top
X3  26.67,15.24 90 top
X4  62.87,36.83 180 top
X5  63.5,16.83 90 top

### Tracks (layer width: path | path; a pad name or v marks a point on that pad's centre or on a via)
+1,5V  (via drill 0.3)
  Top 0.152: X1.10 23.68,44.64 23.65,44.61 v23.65,45.56 | v23.81,27.62 28.1,31.91 32.86,31.91 33.02,32.07 33.92,32.07 X2.10 | JP32.3 16.51,15.88 16.83,15.88 17.94,16.99 v17.94,17.78 | v23.5,21.11 23.5,20.16 24.44,20.16 X3.12 | IC5.8 56.77,11.52 56.67,11.43 56.67,10.26 C53.2 | C53.2 57.09,9.79 56.67,9.37 56.67,8.68 C52.2 55.56,7.36 55.56,5.87 9.53,5.87 9.53,9.53 0.95,9.53 0.64,9.84 0.64,11.11 0.48,11.27 0.48,13.97 | R51.2 C53.2 | 0.48,40.32 | 0.48,26.04 v9.84,26.04 | 0.48,13.97 0.48,26.04 | v9.84,40.64 0.79,40.64 0.48,40.32 | 0.48,13.97 v9.84,13.97 | 0.48,26.04 | 0.48,26.04 0.48,40.32
  Bottom 0.152: v23.81,27.62 16.83,27.62 JP22.3 v9.84,26.04 | JP32.3 14.61,13.97 v9.84,13.97 | v9.84,40.64 JP12.3 19.68,45.09 22.38,45.09 22.86,45.56 v23.65,45.56 | v17.94,17.78 17.46,17.78 17.3,17.94 17.3,20.8 17.62,21.11 23.34,21.11 v23.5,21.11
+3V3  (via drill 0.3)
  Top 0.152: R44.2 63.34,23.87 v63.34,24.45 63.34,26.04 R43.2 63.34,26.41 63.34,28.57 R42.2 63.34,28.95 63.34,30.96 63.5,31.11 R41.2 63.34,31.49 63.34,33.5 63.5,33.66 C41.2 63.34,33.66 63.34,35.4 63.66,35.72 65.09,35.72 65.25,35.88 65.25,37.94 64.77,38.42 IC4.8 v64.77,41.43 | IC1.1 44.3,43.34 44.45,43.5 44.77,43.5 44.93,43.66 C75.2 45.14,46.04 IC7.5 48.1,46.04 48.26,46.2 v48.26,47.94 | IC2.3 53.45,32.5 53.82,32.86 54.45,32.86 54.77,32.54 | 54.77,32.54 54.77,31.91 54.45,31.59 54.45,30.95 IC2.1 | 46.35,17.94 46.35,17.62 46.03,17.3 44.42,17.3 IC3.1 | 46.35,17.94 46.35,18.63 C95.2 46.77,18.95 | IC3.30 45.84,15.67 46.2,16.03 47.94,16.03 v48.42,15.56 48.58,15.56 49.53,14.61 | 54.77,32.54 56.52,32.54 56.67,32.38 C85.2 56.94,32.49 57.31,32.86 57.31,33.34 v57.78,33.81 | 46.35,17.94 47.31,17.94 47.62,17.62 v48.74,17.62 | 49.53,14.61 | 49.53,14.61 R2.2 | R1.2 49.37,16.99 v48.74,17.62 | v48.74,17.62 | C51.2 58.9,7.46 60.01,8.57 60.01,10.95 v59.69,11.27 | 55.46,16.73 55.24,16.51 v55.24,17.94 | v59.69,11.27 59.47,11.49 59.47,11.52 IC5.1 59.44,11.52 v59.69,11.27 | IC6.3 55.46,16.69 55.46,16.73 | IC6.1 56.16,17.69 C63.2 55.46,16.73 | v63.34,20.8 63.34,19.53 62.39,18.57 62.39,16.67 X5.1
  Bottom 0.152: U$1.P9_4 U$1.P9_3 | 65.41,48.9 U$1.P9_4 | 65.41,48.9 | 65.41,48.9 66.2,48.1 66.2,42.86 v64.77,41.43 | v48.42,15.56 48.74,15.88 v48.74,17.62 49.05,17.94 v55.24,17.94 55.24,19.84 58.58,23.18 63.34,23.18 | 63.34,23.18 v63.34,24.45 | 57.78,47.94 61.91,47.94 U$1.P9_4 | 57.78,47.94 v48.26,47.94 | 57.78,47.94 v57.78,33.81 | 63.34,23.18 v63.34,20.8 | v59.69,11.27 59.69,11.75 X5.1
AVDD  (via drill 0.3)
  Top 0.152: IC1.23 43.8,37.48 v43.81,37.47 43.81,36.2 C72.2 L11.1 | IC2.23 53.95,25.1 v53.98,25.08 53.98,23.71 C82.2 | C24.2 49.53,31.75 v50.16,31.11 50.45,30.82 IC2.8 | C14.2 37.78,45.72 v40.01,43.5 40.3,43.21 IC1.8 | C82.2 L21.1 | IC3.23 43.8,11.45 v43.81,11.43 43.81,10.06 C92.2 L31.1 | C34.2 40.01,18 v40.01,17.46 40.3,17.17 IC3.8 | C61.2 C62.2 56.99,19.37 58.1,18.26 v58.74,18.26 58.77,18.23 IC6.8 | IC6.6 59.51,16.69 v59.53,16.67 | C82.2 53.76,23.23 53.98,23.02 53.98,22.86 54.61,22.23 58.58,22.23 v58.74,22.07
  Bottom 0.152: v53.98,25.08 53.98,25.56 51.12,28.42 | 51.12,28.42 50.16,29.37 v50.16,31.11 50.48,31.43 51.44,31.43 51.91,31.91 51.91,35.08 50.32,36.67 44.45,36.67 43.81,37.31 v43.81,37.47 43.81,37.94 40.01,41.75 v40.01,43.5 | 40.32,17.46 40.32,14.92 v43.81,11.43 | v59.53,16.67 59.53,17.46 v58.74,18.26 v58.74,22.07 | 40.32,17.46 41.12,17.46 42.07,18.41 42.07,19.37 51.12,28.42 | 40.32,17.46 v40.01,17.46
CM_6  (via drill 0.3)
  Top 0.152: IC1.7 41.3,44.11 v40.96,44.45 | C16.1 v38.73,43.18 39.05,42.86 39.05,42.55 39.39,42.21 IC1.10 | IC1.12 38.8,41.21 v38.73,41.27
  Bottom 0.152: v40.96,44.45 39.69,44.45 38.73,43.5 v38.73,43.18 v38.73,41.27
CM_7  (via drill 0.3)
  Top 0.152: IC2.12 49.15,28.82 v48.9,28.57 | IC2.7 51.45,31.73 v50.8,32.38 | IC2.10 48.91,29.82 v48.9,29.84 48.58,29.53 48.42,29.53 48.1,29.21 C26.1
  Bottom 0.152: v50.8,32.38 50.16,32.38 48.9,31.11 v48.9,29.84 v48.9,28.57
CM_8  (via drill 0.3)
  Top 0.152: IC3.10 39.29,16.17 C36.1 38.1,17.14 v38.1,18.1 | IC3.7 41.3,18.08 v40.64,18.73 | IC3.12 39.3,15.17 v39.21,15.08
  Bottom 0.152: v39.21,15.08 39.05,15.24 39.05,18.1 | 39.05,18.1 39.69,18.73 v40.64,18.73 | 39.05,18.1 v38.1,18.1
CODEC_AUDIO_ADC_SDATA_A
  Top 0.152: IC1.26 45.74,39.71 46.04,40.01 49.37,40.01 49.72,40.35 IC7.1
CODEC_AUDIO_ADC_SDATA_B  (via drill 0.3)
  Top 0.152: IC2.26 55.86,27.32 v55.88,27.3 | v49.69,39.05 50.64,40.01 50.64,46.67 50.33,46.99 IC7.3
  Bottom 0.152: v55.88,27.3 55.88,27.94 52.55,31.27 52.55,35.4 49.69,38.26 v49.69,39.05
CODEC_AUDIO_ADC_SDATA_C  (via drill 0.3)
  Top 0.152: IC3.26 45.7,13.67 v45.72,13.65 | v49.21,40.8 49.21,42.23 47.31,44.13 47.31,44.9 IC7.6
  Bottom 0.152: v45.72,13.65 45.72,14.29 45.09,14.92 45.09,16.19 44.13,17.14 44.13,18.73 46.67,21.27 52.55,21.27 56.36,25.08 56.36,25.72 55.24,26.83 55.24,28.1 52.23,31.11 52.23,35.24 48.9,38.58 48.9,40.48 v49.21,40.8
CODEC_AUDIO_ADC_SDATA_OR
  Top 0.152: U$1.P9_30 32.86,48.42 46.2,48.42 47.12,47.5 IC7.4
CODEC_AUDIO_BCLK  (via drill 0.3)
  Top 0.152: IC1.28 45.47,40.71 45.56,40.8 46.99,40.8 v47.62,41.43 | IC3.28 47.06,14.67 v47.15,14.76 | IC2.28 57.08,28.32 57.78,27.62 v57.78,27.46
  Bottom 0.152: U$1.P9_31 29.69,51.59 31.75,51.59 32.07,51.28 34.13,51.28 34.77,50.64 34.77,49.53 35.88,48.42 40.16,48.42 42.86,45.72 42.86,44.45 46.2,41.12 47.15,41.12 47.47,41.43 v47.62,41.43 47.94,41.75 49.53,41.75 50.64,40.64 50.64,38.26 53.18,35.72 53.18,31.59 56.36,28.42 56.99,28.42 57.47,27.94 57.78,27.62 v57.78,27.46 58.1,27.15 58.1,25.88 57.63,25.4 56.52,24.29 52.86,20.64 46.99,20.64 44.77,18.41 44.77,17.46 45.72,16.51 45.72,15.24 46.35,14.61 46.99,14.61 v47.15,14.76
CODEC_AUDIO_DAC_SDATA  (via drill 0.3)
  Top 0.152: IC1.27 45.6,40.21 45.88,40.48 47.31,40.48 47.47,40.64 v48.26,40.64 | IC2.27 55.45,27.82 55.56,27.94 56.52,27.94 v56.83,27.62 | IC3.27 45.29,14.17 45.4,14.29 46.35,14.29 v46.67,13.97
  Bottom 0.152: U$1.P9_28 | U$1.P9_28 35.72,48.1 40.01,48.1 42.55,45.56 42.55,44.29 46.04,40.8 48.1,40.8 v48.26,40.64 48.9,41.43 49.37,41.43 50.32,40.48 50.32,38.1 52.86,35.56 52.86,31.43 | v46.67,13.97 46.51,13.97 45.4,15.08 45.4,16.35 44.45,17.3 44.45,18.57 46.83,20.95 52.7,20.95 57.78,26.04 57.78,26.51 57.15,27.15 57.15,27.3 v56.83,27.62 56.67,27.62 52.86,31.43 | 52.86,31.43
CODEC_AUDIO_LRCLK  (via drill 0.3)
  Top 0.152: IC1.29 45.97,41.21 v46.67,41.91 | IC3.29 46.29,15.17 v46.51,15.4 | v57.94,28.42 57.63,28.73 | 57.63,28.73 | IC2.29 57.53,28.82 57.63,28.73
  Bottom 0.152: 35.08,49.69 36.04,48.74 40.32,48.74 43.18,45.88 43.18,44.61 45.88,41.91 v46.67,41.91 46.83,42.07 | U$1.P9_29 32.23,51.59 34.29,51.59 35.08,50.8 35.08,49.69 | 35.08,49.69 | 46.83,42.07 49.69,42.07 50.96,40.8 50.96,38.42 53.5,35.88 53.5,31.75 56.52,28.73 57.63,28.73 v57.94,28.42 58.42,27.94 | 46.83,42.07 | 56.83,24.13 53.02,20.32 47.15,20.32 45.09,18.26 45.09,17.62 46.04,16.67 46.04,15.88 v46.51,15.4 | 56.83,24.13 | 56.83,24.13 58.42,25.72 58.42,27.94 | 58.42,27.94 | v46.51,15.4
CODEC_CNTRL_SCL  (via drill 0.3)
  Top 0.152: IC1.32 44.92,43.02 v45.72,43.81 | IC4.6 62.23,39.05 61.75,38.58 60.48,38.58 60.17,38.89 v52.39,38.89 | IC3.32 45.41,16.67 45.56,16.83 46.51,16.83 v46.99,17.3 48.1,17.3 49.37,16.03 50.96,16.03 51.91,16.99 R1.1 | IC2.32 55.57,30.32 55.88,30.64 v55.88,31.11
  Bottom 0.152: U$1.P9_19 42.7,51.59 42.7,49.69 43.34,49.05 44.45,49.05 46.35,47.15 46.35,44.45 v45.72,43.81 46.35,43.18 50.01,43.18 52.39,40.8 v52.39,38.89 55.88,35.4 v55.88,31.11 56.2,30.8 56.2,30.64 56.52,30.32 58.1,30.32 59.05,29.37 59.05,25.4 58.9,25.24 | v46.99,17.3 46.99,19.21 47.47,19.68 53.34,19.68 58.9,25.24 | 58.9,25.24
CODEC_CNTRL_SDA  (via drill 0.3)
  Top 0.152: v46.67,43.81 45.72,42.86 45.72,42.39 45.56,42.23 45.4,42.23 45.38,42.21 IC1.31 | IC2.31 55.7,29.82 55.72,29.84 | 55.72,29.84 | v56.83,30.96 55.72,29.84 | IC4.5 60.96,39.21 53.34,39.21 v53.02,39.53 | IC3.31 45.7,16.17 45.88,16.35 46.99,16.35 47.31,16.67 v47.78,16.67 48.26,16.67 48.58,16.35 | 48.58,16.35 | 48.58,16.35 49.37,15.56 50.86,15.56 R2.1
  Bottom 0.152: U$1.P9_20 46.67,47.31 v46.67,43.81 46.99,43.5 50.16,43.5 52.7,40.96 52.7,39.85 v53.02,39.53 53.02,38.73 56.2,35.56 56.2,31.75 56.83,31.11 v56.83,30.96 57.15,30.64 58.26,30.64 59.37,29.53 59.37,25.24 54.45,20.32 | v47.78,16.67 47.78,17.46 47.31,17.94 47.31,19.05 47.62,19.37 53.5,19.37 54.45,20.32 | 54.45,20.32
DVDDOUT_6
  Top 0.152: C73.1 46.35,36.2 46.35,38.31 C74.2 | C74.2 46.62,38.58 | IC1.24 44.32,38.73 C74.2
DVDDOUT_7
  Top 0.152: C83.1 56.52,23.5 56.52,25.61 C84.2 | C84.2 56.77,26.2 | IC2.24 54.74,26.04 C84.2
DVDDOUT_8
  Top 0.152: C94.2 46.61,12.55 | C94.2 46.51,12.38 46.35,12.22 46.35,10.26 C93.1 | IC3.24 44.59,12.38 C94.2
GND  (via drill 0.3)
  Top 0.152: IC1.22 43.3,39.89 | 43.18,41.91 43.18,42.55 | 43.3,42.02 IC1.3 | IC1.30 43.61,41.71 43.3,42.02 | 43.81,39.69 44.13,39.37 44.29,39.37 44.45,39.21 44.92,39.21 | 44.92,39.21 44.93,39.21 | IC1.25 44.92,39.21 | 41.59,41.91 40.96,42.55 40.8,42.55 40.64,42.7 40.17,42.7 IC1.9 | IC3.3 43.3,15.99 43.18,15.88 43.18,15.56 IC3.EXP | 42.55,15.08 40.96,16.67 40.17,16.67 IC3.9 | IC2.22 53.45,27.19 53.66,27.39 53.66,27.62 | IC2.30 54.09,29.32 53.98,29.21 | 55.08,26.83 IC2.25 | IC2.EXP | IC2.EXP 50.96,30.32 50.33,30.32 IC2.9 | IC2.EXP | 53.66,27.62 54.45,26.83 55.08,26.83 | IC2.EXP 53.66,27.62 | IC1.EXP 42.55,41.27 43.18,41.91 | 43.18,41.91 43.3,42.02 | 43.3,13.86 43.3,13.54 43.34,13.49 43.3,13.45 IC3.22 | 55.08,26.83 55.24,26.83 55.56,26.51 56.04,26.51 | 43.97,13.49 44.29,13.18 45.24,13.18 45.24,13.17 IC3.25 | 45.25,13.17 | 45.25,13.17 45.56,12.86 45.88,12.86 | IC6.2 57.84,17.19 | IC6.5 58.27,16.19 58.1,16.35 | 58.1,16.35 58.1,16.77 | IC6.4 57.62,16.19 57.78,16.35 58.1,16.35 | IC5.2 58.2,12.02 IC5.EP | IC5.4 58.43,13.02 58.26,12.86
  other vias: 55.56,15.88 56.04,13.49 57.78,15.56 42.7,11.43 43.34,18.73 50.48,24.77 48.1,30.64 40.64,37.31 38.1,44.45 43.18,47.47 48.42,44.29 59.05,30.96 49.85,18.57 48.42,13.97 47.62,37.46 36.67,18.41 60.96,43.5 57.94,10.95
  pour Top: 0.64,33.66 17.78,33.66 19.05,34.92 51.44,34.92 51.44,47.15 66.04,47.15 66.04,33.66 86.36,33.66 86.36,54.61 75.56,54.61 75.56,48.74 9.53,48.74 9.53,45.09 0.64,45.09
  pour Top: 0.64,9.53 9.53,9.53 9.53,5.87 52.55,5.87 52.55,21.59 40.16,21.59 39.21,22.54 23.02,22.54 21.43,20.95 0.64,20.95
  pour Top: 0.64,21.27 21.27,21.27 22.86,22.86 39.37,22.86 40.32,21.91 52.86,21.91 52.86,21.11 60.64,21.11 60.64,5.87 80.49,5.87 80.49,15.72 65.88,15.72 65.88,22.07 60.33,22.07 60.33,34.61 19.21,34.61 17.94,33.34 0.64,33.34
  pour Top: 51.75,46.83 65.72,46.83 65.72,22.38 60.64,22.38 60.64,34.92 51.75,34.92
  pour Bottom: 0.16,45.09 9.53,45.09 9.53,54.45 67.94,54.45 67.94,48.26 86.36,48.26 86.2,33.81 65.88,33.81 65.88,15.72 80.49,15.72 80.49,5.87 67.94,5.87 67.94,0.16 9.53,0.16 9.53,9.53 0.32,9.53 0.32,9.84
  pour Top: 52.86,5.87 60.33,5.87 60.33,20.32 52.86,20.32
JACKDET6  (via drill 0.3)
  Top 0.152: IC1.4 42.8,44.84 40.01,47.62 v30.8,47.62 | X1.9 29.72,44.64 v30.8,45.72
  Bottom 0.152: v30.8,45.72 v30.8,47.62
JACKDET7  (via drill 0.3)
  Top 0.152: X2.9 40.04,31.94 v40.32,32.23 | v40.32,33.97 40.64,33.66 51.44,33.66 52.95,32.13 IC2.4
  Bottom 0.152: v40.32,32.23 v40.32,33.97
JACKDET8  (via drill 0.3)
  Top 0.152: IC3.4 42.8,18.48 39.69,21.59 30.96,21.59 v30.8,21.75 | X3.11 30.72,20.24 v30.8,20.32
  Bottom 0.152: v30.8,20.32 v30.8,21.75
LAUX_6
  Top 0.152: X1.6 25.4,40.64 26.51,41.75 30.32,41.75 30.8,42.23 30.8,44.35 C13.1
LAUX_7
  Top 0.152: X2.6 34.92,27.94 36.04,29.05 40.16,29.05 40.64,29.53 40.64,30.7 C23.1
LAUX_8
  Top 0.152: C33.1 30.8,18.31 30.8,17.78 30.48,17.46 26.99,17.46 26.04,16.51 24.79,16.51 X3.8
LHP_6  (via drill 0.3)
  Top 0.152: IC1.20 42.3,37.87 v42.55,37.62 | v50.01,35.56 51.12,35.56 51.12,47.31 51.28,47.47 66.2,47.47 | 66.2,47.47 | 66.2,47.47 66.36,47.31 66.36,46.35 C76.+
  Bottom 0.152: v42.55,37.62 42.55,37.15 44.13,35.56 v50.01,35.56
LHP_7  (via drill 0.3)
  Top 0.152: IC2.20 52.45,25.33 v52.7,25.08 | 52.23,21.75 | 52.23,21.75 53.02,20.95 60.64,20.95 60.96,20.64 60.96,13.34 61.12,13.18 61.12,12.92 C86.+ | 52.23,21.75 v52.23,21.91
  Bottom 0.152: v52.23,21.91 52.23,22.07 52.07,22.23 52.07,24.29 52.7,24.92 v52.7,25.08
LHP_8
  Top 0.152: IC3.20 42.3,12.13 41.43,11.27 39.69,11.27 38.73,12.22 36.99,12.22 36.35,11.59 36.35,10.64 35.4,9.68 30.64,9.68 30.32,9.37 26.35,9.37 25.4,10.32 24.6,10.32 X3.2
LINN_6
  Top 0.152: C15.2 33.97,43.18 35.24,41.91 39.05,41.91 39.26,41.71 IC1.11
LINN_7
  Top 0.152: IC2.11 49.65,29.32 49.53,29.21 48.58,29.21 48.26,28.89 48.26,28.26 47.94,27.94 44.66,27.94 C25.2
LINN_8
  Top 0.152: IC3.11 39.26,15.67 39.05,15.88 35.14,15.88 C35.2
LOUTN_6
  Top 0.152: IC1.17 40.8,38.73 37.31,38.73 34.77,36.2 29.27,36.2 X1.1
LOUTN_7
  Top 0.152: X2.1 38.47,23.81 39.53,23.81 40.64,22.7 44.45,22.7 44.93,23.18 44.93,24.13 45.24,24.45 45.24,26.04 45.56,26.35 50.01,26.35 50.16,26.2 50.83,26.2 IC2.17
LOUTN_8
  Top 0.152: X3.4 24.7,12.06 25.24,12.06 26.19,13.02 30.48,13.02 30.64,12.86 30.64,11.11 31.11,10.64 34.92,10.64 35.4,11.11 35.4,12.06 36.51,13.18 39.21,13.18 39.84,12.55 40.67,12.55 IC3.17
LOUTP_6
  Top 0.152: IC1.18 41.3,38.2 41.04,37.94 40.48,37.94 40.32,38.1 40.32,38.26 40.16,38.42 37.47,38.42 34.92,35.88 27.15,35.88 26.35,36.67 24.55,36.67 X1.2
LOUTP_7
  Top 0.152: IC2.18 51.45,25.74 51.28,25.56 50.64,25.56 50.32,25.88 50.01,25.88 49.85,26.04 45.88,26.04 45.56,25.72 45.56,24.29 45.24,23.97 45.24,23.02 44.61,22.38 40.48,22.38 39.69,23.18 36.51,23.18 35.88,23.81 34.17,23.81 X2.2
LOUTP_8
  Top 0.152: IC3.18 41.3,12.09 41.12,11.91 40.01,11.91 39.05,12.86 36.67,12.86 35.72,11.91 35.72,10.95 35.08,10.32 30.96,10.32 30.32,10.95 30.32,11.59 29.84,12.06 29,12.06 X3.3
MCLK  (via drill 0.3)
  Top 0.152: IC2.2 53.95,32.05 v54.13,32.23 | IC3.2 43.8,17.76 43.97,17.94 v45.72,17.94 | v43.81,44.77 43.8,44.75 IC1.2
  Bottom 0.152: U$1.P9_25 37.62,51.28 37.62,49.69 38.26,49.05 40.48,49.05 43.81,45.72 v43.81,44.77 43.81,44.49 43.8,44.47 45.72,42.55 47.94,42.55 48.1,42.39 50.01,42.39 51.28,41.12 51.28,38.58 53.82,36.04 53.82,32.54 v54.13,32.23 54.13,31.59 56.52,29.21 58.1,29.21 58.74,28.57 58.74,25.56 53.82,20.64 53.18,20 47.31,20 45.88,18.57 45.72,18.41 v45.72,17.94
MIC1L
  Top 0.152: MIC1.2 12.7,39.37 12.7,36.83 13.34,36.2 15.88,36.2 | 15.88,36.2 15.88,35.14 C12.2 | 15.88,36.2 15.88,37.25 R12.2 | 15.88,36.2 20.95,36.2 21.17,36.41 R14.1 22.23,38.52 22.23,39.37 22.7,39.85 26.04,39.85 26.67,40.48 26.67,41.12 26.99,41.43 30.48,41.43 31.11,42.07 31.11,42.86 31.43,43.18 C15.1
MIC1R  (via drill 0.3)
  Top 0.152: MIC1.3 9.75,43.41 11.43,45.09 15.88,45.09 | 15.88,45.09 15.88,44.03 C11.2 | 15.88,45.09 15.88,46.35 R11.2 JP11.2 18.68,47.42 18.89,47.62 v26.67,47.62 | C17.1 32.17,41.01 32.07,41.12 v32.07,41.59
  Bottom 0.152: v32.07,41.59 32.07,42.23 v26.67,47.62
MIC2L
  Top 0.152: MIC2.2 12.8,25.3 13.65,24.45 15.56,24.45 15.88,24.13 15.88,23.07 R22.2 17.14,22.86 18.41,21.59 20.64,21.59 20.95,21.91 20.95,22.64 R24.1 | R24.1 21.38,22.86 | C25.1 40.8,29.21 40.32,28.73 36.35,28.73 36.04,28.42 36.04,27.46 35.72,27.15 30.32,27.15 27.94,24.77 24.61,24.77 | 24.61,24.77 23.07,24.77 R24.1 | C22.2 24.55,24.82 24.61,24.77
MIC2R  (via drill 0.3)
  Top 0.152: 10.16,31.11 12.7,31.11 13.34,30.48 15.88,30.48 | 15.88,30.48 15.88,31.54 R21.2 JP21.2 18.68,32.66 20,33.97 v36.2,33.97 | C21.2 15.88,29.21 15.88,30.48 | C27.1 41.7,26.89 41.59,26.99 v41.59,27.62
  Top 0.406: MIC2.3 10.16,31.2 10.16,31.11
  Bottom 0.152: v41.59,27.62 41.59,28.57 v36.2,33.97
MIC3L
  Top 0.152: MIC3.2 12.8,13.23 13.81,12.22 15.72,12.22 15.88,12.06 15.88,11.01 R32.2 15.88,10.58 15.88,9.37 | C32.2 15.88,8.47 15.88,9.37 | R34.1 21.17,10.69 | 31.75,17.14 C35.1 27.3,17.14 26.67,16.51 26.67,15.88 26.19,15.4 22.86,15.4 22.54,15.08 22.54,12.17 R34.1 | 15.88,9.37 20.48,9.37 20.95,9.84 20.95,10.58 R34.1
MIC3R  (via drill 0.3)
  Top 0.152: 15.88,18.41 15.88,17.36 C31.2 | 15.88,18.41 15.88,19.05 16.09,19.27 R31.2 JP31.2 18.89,19.68 v20.32,18.26 | MIC3.3 12.61,19.14 13.34,18.41 15.88,18.41 | C37.1 32.07,14.61 v32.07,15.56
  Bottom 0.152: v32.07,15.56 23.02,15.56 v20.32,18.26
MICBIAS_6
  Top 0.152: IC1.5 42.3,44.7 39.69,47.31 31.43,47.31 30.8,46.67 23.18,46.67 22.38,45.88 22.38,42.7 22.23,42.55 21.59,42.55 20.32,41.27 JP12.1
MICBIAS_7
  Top 0.152: IC2.5 52.45,32.16 51.28,33.34 40.64,33.34 40.48,33.18 36.83,33.18 36.67,33.02 35.72,33.02 35.56,33.18 27.46,33.18 JP22.1
MICBIAS_8
  Top 0.152: IC3.5 42.3,18.51 39.53,21.27 31.27,21.27 31.11,21.11 | JP32.1 20.95,14.61 22.23,15.88 22.23,20.8 23.18,21.75 23.81,21.75 24.45,21.11 31.11,21.11 | 31.11,21.11
N$1
  Top 0.152: L31.2 C91.2
N$2
  Top 0.152: L11.2 C71.2
N$3
  Top 0.152: IC2.6 51.95,32.18 51.12,33.02 43.81,33.02 43.4,32.6 C23.2
N$4
  Top 0.152: IC2.14 49.57,27.82 49.37,27.62 48.58,27.62 48.26,27.3 44.61,27.3 44.29,26.99 44.29,25.03 C28.2
N$5
  Top 0.152: C13.2 33.97,45.72 35.24,46.99 39.37,46.99 41.8,44.56 IC1.6
N$6
  Top 0.152: IC1.14 35.98,40.21 C18.2
N$7  (via drill 0.3)
  Top 0.152: R53.2 56.2,14.61 | 56.2,14.61 | 56.2,14.61 59.05,14.61 v59.53,14.13 | IC5.3 59.67,12.52 60.01,12.86 | 60.01,12.86 | v59.53,14.13 | 60.01,12.86 60.01,13.65 v59.53,14.13
  Bottom 0.152: X5.2 62.71,17.3 62.07,16.67 | 62.07,16.67 | v59.53,14.13 62.07,16.67
N$8  (via drill 0.3)
  Top 0.152: R42.1 62.02,28.68 62.07,28.73 v62.07,29.53 | v61.75,41.91 62.23,42.39 IC4.3
  Bottom 0.152: v61.75,41.91 61.12,41.91 60.33,41.12 60.33,40.32 60.01,40.01 60.01,36.2 62.07,34.13 v62.07,29.53
N$9  (via drill 0.3)
  Top 0.152: v63.5,43.66 IC4.2 | v62.07,26.99 62.07,26.09 R43.1 | v59.69,41.91 58.1,41.91 56.52,43.5 S4.3
  Bottom 0.152: v63.5,43.66 63.5,43.18 63.18,42.86 60.64,42.86 v59.69,41.91 59.05,41.27 59.05,40.32 59.37,40.01 59.37,35.88 61.44,33.81 61.44,30.32 61.12,30 61.12,29.05 62.39,27.78 62.39,27.3 v62.07,26.99
N$10  (via drill 0.3)
  Top 0.152: v64.77,43.66 IC4.1 | S4.4 53.98,42.39 55.72,40.64 v59.69,40.64 | v62.07,24.45 62.07,23.55 R44.1
  Bottom 0.152: v62.07,24.45 62.71,25.08 62.71,27.94 61.44,29.21 61.44,29.84 61.75,30.16 61.75,33.97 59.69,36.04 v59.69,40.64 59.69,40.96 60.48,41.75 60.48,42.23 60.8,42.55 63.66,42.55 v64.77,43.66
N$11
  Top 0.152: IC4.7 63.5,37.47 X4.1 62.87,35.56 62.87,31.96 R41.1
N$12
  Top 0.152: IC3.6 41.8,18.53 40.96,19.37 39.37,20.95 35.14,20.95 C33.2
N$13
  Top 0.152: IC3.14 39.73,14.17 39.69,14.13 35.93,14.13 C38.2
N$14
  Top 0.152: R13.1 21.17,45.87 JP11.1
N$15
  Top 0.152: JP21.1 20.95,31.75 21.11,31.59 21.11,29.27 R23.1
N$18
  Top 0.152: JP31.1 20.8,19.68 20.95,19.53 20.95,17.36 R33.1
N$27
  Top 0.152: IC5.7 56.47,12.02 56.2,11.75 56.2,10.79 56.04,10.64 54.77,10.64 54.61,10.48 54.61,9.05 54.13,8.57 54.13,7.94 53.76,7.56 C52.1
N$28
  Top 0.152: IC5.6 55.76,12.52 R52.2 55.88,11.8 55.88,11.11 55.72,10.95 54.61,10.95 54.13,10.48 54.13,10.32 53.76,9.95 R51.1
N$29
  Top 0.152: R33.2 17.78,15.46 JP32.2 17.78,12.48 R34.2
N$31
  Top 0.152: R13.2 19.05,43.4 19.05,43.18 17.78,41.91 JP12.2 17.78,39.37 19.05,38.1 19.05,37.88 R14.2
N$32
  Top 0.152: R23.2 17.78,27.52 JP22.2 17.78,24.55 R24.2
N$34
  Top 0.152: C62.1 59.05,19.37 59.37,19.05 59.37,17.3 59.26,17.19 IC6.7
N$56
  Top 0.152: C87.- 68.9,8.26 HP2.3
N$65
  Top 0.152: C86.- 65.03,11.97 66.04,10.95 67.05,10.95 HP2.2
N$91
  Top 0.152: L21.2 C81.2
N$94
  Top 0.152: C77.- 74.61,42.55 HP1.3
N$95
  Top 0.152: C76.- 71.66,46.35 HP1.2
RAUX_6
  Top 0.152: C18.1 32.07,38.1 | C18.1 32.07,38.2 | X1.5 30.32,40.64 32.17,38.79 C18.1
RAUX_7
  Top 0.152: C28.1 41.59,24.13 40.8,24.92 40.8,27.46 40.32,27.94 X2.5
RAUX_8
  Top 0.152: X3.7 28.87,16.19 30.8,16.19 30.96,16.03 30.96,13.97 31.75,13.18 31.75,12.06 C38.1
RHP_6  (via drill 0.3)
  Top 0.152: IC1.19 41.8,37.83 v41.59,37.62 | v50.8,34.92 51.12,34.92 51.44,35.24 51.44,47.15 66.04,47.15 66.04,42.55 C77.+
  Bottom 0.152: v50.8,34.92 49.69,34.92 49.37,35.24 43.97,35.24 v41.59,37.62
RHP_7  (via drill 0.3)
  Top 0.152: IC2.19 51.95,25.29 v51.75,25.08 | v51.28,21.91 51.91,21.27 52.23,21.27 52.86,20.64 60.48,20.64 | C87.+ 61.91,8.32 61.91,8.73 60.64,10 60.64,20.48 60.48,20.64 | 60.48,20.64
  Bottom 0.152: v51.28,21.91 51.75,22.38 v51.75,25.08
RHP_8
  Top 0.152: IC3.19 41.8,12.11 41.27,11.59 39.85,11.59 38.89,12.54 36.83,12.54 36.04,11.75 36.04,10.79 35.24,10 29.06,10 X3.1
RINN_6
  Top 0.152: IC1.13 39.44,40.71 39.37,40.64 C17.2
RINN_7
  Top 0.152: IC2.13 49.6,28.32 49.21,27.94 48.42,27.94 48.1,27.62 44.35,27.62 C27.2
RINN_8
  Top 0.152: IC3.13 39.76,14.67 39.53,14.45 34.03,14.45 C37.2
ROUTN_6
  Top 0.152: IC1.16 37.3,39.21 34.61,36.51 31.11,36.51 30.48,37.15 30.48,38.42 30.32,38.58 28.88,38.58 X1.3
ROUTN_7
  Top 0.152: IC2.16 48.73,26.82 48.58,26.67 45.24,26.67 44.93,26.35 44.93,24.61 44.61,24.29 44.61,23.34 44.29,23.02 40.8,23.02 40.16,23.65 40.16,25.72 40.01,25.88 38.41,25.88 X2.3
ROUTN_8
  Top 0.152: IC3.16 39.69,13.17 39.37,13.49 36.35,13.49 35.08,12.22 35.08,11.27 34.77,10.95 31.27,10.95 30.96,11.27 30.96,13.02 29.69,14.29 28.87,14.29 X3.5
ROUTP_6
  Top 0.152: IC1.15 37.33,39.71 34.45,36.83 31.27,36.83 30.8,37.31 30.8,39.05 30.32,39.53 26.83,39.53 26.04,38.73 24.61,38.73 X1.4
ROUTP_7
  Top 0.152: IC2.15 49.55,27.32 49.53,27.3 48.74,27.3 48.42,26.99 44.93,26.99 44.61,26.67 44.61,24.77 44.29,24.45 44.29,23.5 44.13,23.34 40.96,23.34 40.48,23.81 40.48,26.35 40.01,26.83 36.67,26.83 35.78,25.94 X2.4
ROUTP_8
  Top 0.152: IC3.15 39.67,13.67 39.53,13.81 36.2,13.81 34.77,12.38 34.77,11.43 34.61,11.27 31.43,11.27 31.27,11.43 31.27,13.18 30.64,13.81 30.64,14.92 30.48,15.08 27.15,15.08 26.35,14.29 24.57,14.29 X3.6

### Text on the board
Top: BeagleBone Cape AD/DA Cape4all 05/2018